# Altium schematic sheet Контроллер.SchDoc
size 209 x 297 mm; Scale: 1:1; DocumentType: Схема электрическая принципиальная; FirstReferrence: АБВГ.123456.001
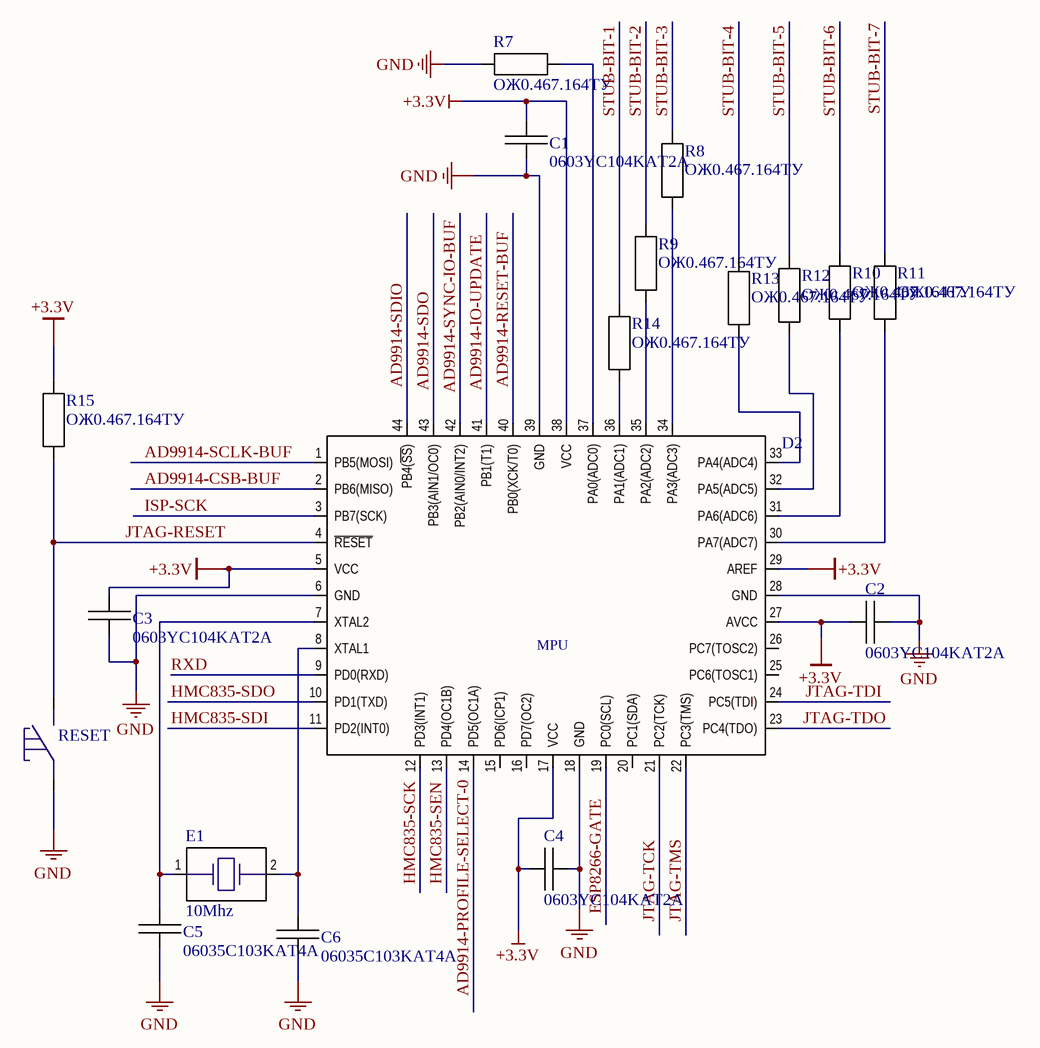
[diagram p0: Контроллер.SchDoc]

## Parts
C1  0603YC104KAT2A  [0603-AVX]
C2  0603YC104KAT2A  [0603-AVX]
C3  0603YC104KAT2A  [0603-AVX]
C4  0603YC104KAT2A  [0603-AVX]
C5  06035C103KAT4A  [0603-AVX]
C6  06035C103KAT4A  [0603-AVX]
D2  (no value)  [LQFP-44]
E1  10Mhz  [HC49]
R7  ОЖ0.467.164ТУ  [Р1-8МП-0,125]
R8  ОЖ0.467.164ТУ  [Р1-8МП-0,125]
R9  ОЖ0.467.164ТУ  [Р1-8МП-0,125]
R10  ОЖ0.467.164ТУ  [Р1-8МП-0,125]
R11  ОЖ0.467.164ТУ  [Р1-8МП-0,125]
R12  ОЖ0.467.164ТУ  [Р1-8МП-0,125]
R13  ОЖ0.467.164ТУ  [Р1-8МП-0,125]
R14  ОЖ0.467.164ТУ  [Р1-8МП-0,125]
R15  ОЖ0.467.164ТУ  [Р1-8МП-0,125]
RESET  Кнопка тактовая smd  [Кнопка тактовая smd]  (value not drawn)

## Nets
1: RESET.2
3: RESET.4
+3.3V: C1.1 C2.2 C3.2 C4.2 D2.5(VCC) D2.17(VCC) D2.27(AVCC) D2.29(AREF) D2.38(VCC) R15.1
GND: C1.2 C2.1 C3.1 C4.1 C5.1 C6.1 D2.6(GND) D2.18(GND) D2.28(GND) D2.39(GND) R7.1 RESET.1
AD9914-CSB-BUF: D2.2(PB6(MISO))
AD9914-IO-UPDATE: D2.41(PB1(T1))
AD9914-PROFILE-SELECT-0: D2.14(PD5(OC1A))
AD9914-RESET-BUF: D2.40(PB0(XCK/T0))
AD9914-SCLK-BUF: D2.1(PB5(MOSI))
AD9914-SDIO: D2.44(PB4(~{SS}))
AD9914-SDO: D2.43(PB3(AIN1/OC0))
AD9914-SYNC-IO-BUF: D2.42(PB2(AIN0/INT2))
ESP8266-GATE: D2.19(PC0(SCL))
HMC835-SCK: D2.12(PD3(INT1))
HMC835-SDI: D2.11(PD2(INT0))
HMC835-SDO: D2.10(PD1(TXD))
HMC835-SEN: D2.13(PD4(OC1B))
ISP-SCK: D2.3(PB7(SCK))
JTAG-RESET: D2.4(~{RESET}) R15.2 RESET.3
JTAG-TCK: D2.21(PC2(TCK))
JTAG-TDI: D2.24(PC5(TDI))
JTAG-TDO: D2.23(PC4(TDO))
JTAG-TMS: D2.22(PC3(TMS))
RXD: D2.9(PD0(RXD))
STUB-BIT-1: R14.2
STUB-BIT-2: R9.2
STUB-BIT-3: R8.2
STUB-BIT-4: R13.2
STUB-BIT-5: R12.2
STUB-BIT-6: R10.2
STUB-BIT-7: R11.2
NetC5_2: C5.2 D2.7(XTAL2) E1.1
NetC6_2: C6.2 D2.8(XTAL1) E1.2
NetD2_30: D2.30(PA7(ADC7)) R11.1
NetD2_31: D2.31(PA6(ADC6)) R10.1
NetD2_32: D2.32(PA5(ADC5)) R12.1
NetD2_33: D2.33(PA4(ADC4)) R13.1
NetD2_34: D2.34(PA3(ADC3)) R8.1
NetD2_35: D2.35(PA2(ADC2)) R9.1
NetD2_36: D2.36(PA1(ADC1)) R14.1
NetD2_37: D2.37(PA0(ADC0)) R7.2

Not connected (* = marked no-connect by the designer): D2 15(PD6(ICP1)) 16(PD7(OC2)) 20(PC1(SDA)) 25(PC6(TOSC1)) 26(PC7(TOSC2))

## Notes on the sheet
- Перв. примен.
- Справ. №
- Подп. и дата
- Инв. № дубл.
- Взам. инв. №
- Разраб.
- Изм.
- Лист
- № докум.
- Подп.
- Дата
- Лит.
- Масса
- Масштаб
- Пров.
- Т.контр.
- Листов
- Инв. № подл.
- Утв.
- Н.контр.
- 2.106-A4
- Копировал
- Формат А4
- (in symbol ATmega16) MPU

## Library data of the parts
C1-C4 = 0603-X7R-0,1мкФ-16В-10%: Manufacturer: AVX; TKE: X7R; Power/Voltage: 16 В; Tolerance: ±10%; Value: 0,1 мкФ; Category: Конденсатор; ManufacturerPartNumber: 0603YC104KAT2A; PartNumber: 0603YC104KAT2A
C5 C6 = 0603-X7R-0,01мкФ-50В-10%: Manufacturer: AVX; TKE: X7R; Power/Voltage: 50 В; Tolerance: ±10%; Value: 15 пФ; Category: Конденсатор; ManufacturerPartNumber: 06035C103KAT4A; PartNumber: 06035C103KAT4A
D2 = ATmega16: AVR 8-bit microcontroller; Manufacturer: Atmel; Category: Микросхема; ManufacturerPartNumber: ATmega16
E1 = Crystal oscillator 16Mhz: Value: 16 МГц; Category: Генератор; ManufacturerPartNumber: Crystal oscillator 16Mhz
R7-R15 = Р1-8МП-0,125-100 Ом±1%: ManufacturerPartNumber: Р1-8МП-0,125-100 Ом±1%-0,5-Л; Value: 1 кОм; Tolerance: ±1%-0,5-Л; Power/Voltage: 0,125; Category: Резистор; PartNumber: ОЖ0.467.164ТУ
RESET = Кнопка тактовая smd: Category: Соединитель